# EAGLE design untitled (EAGLE 7.6.0)
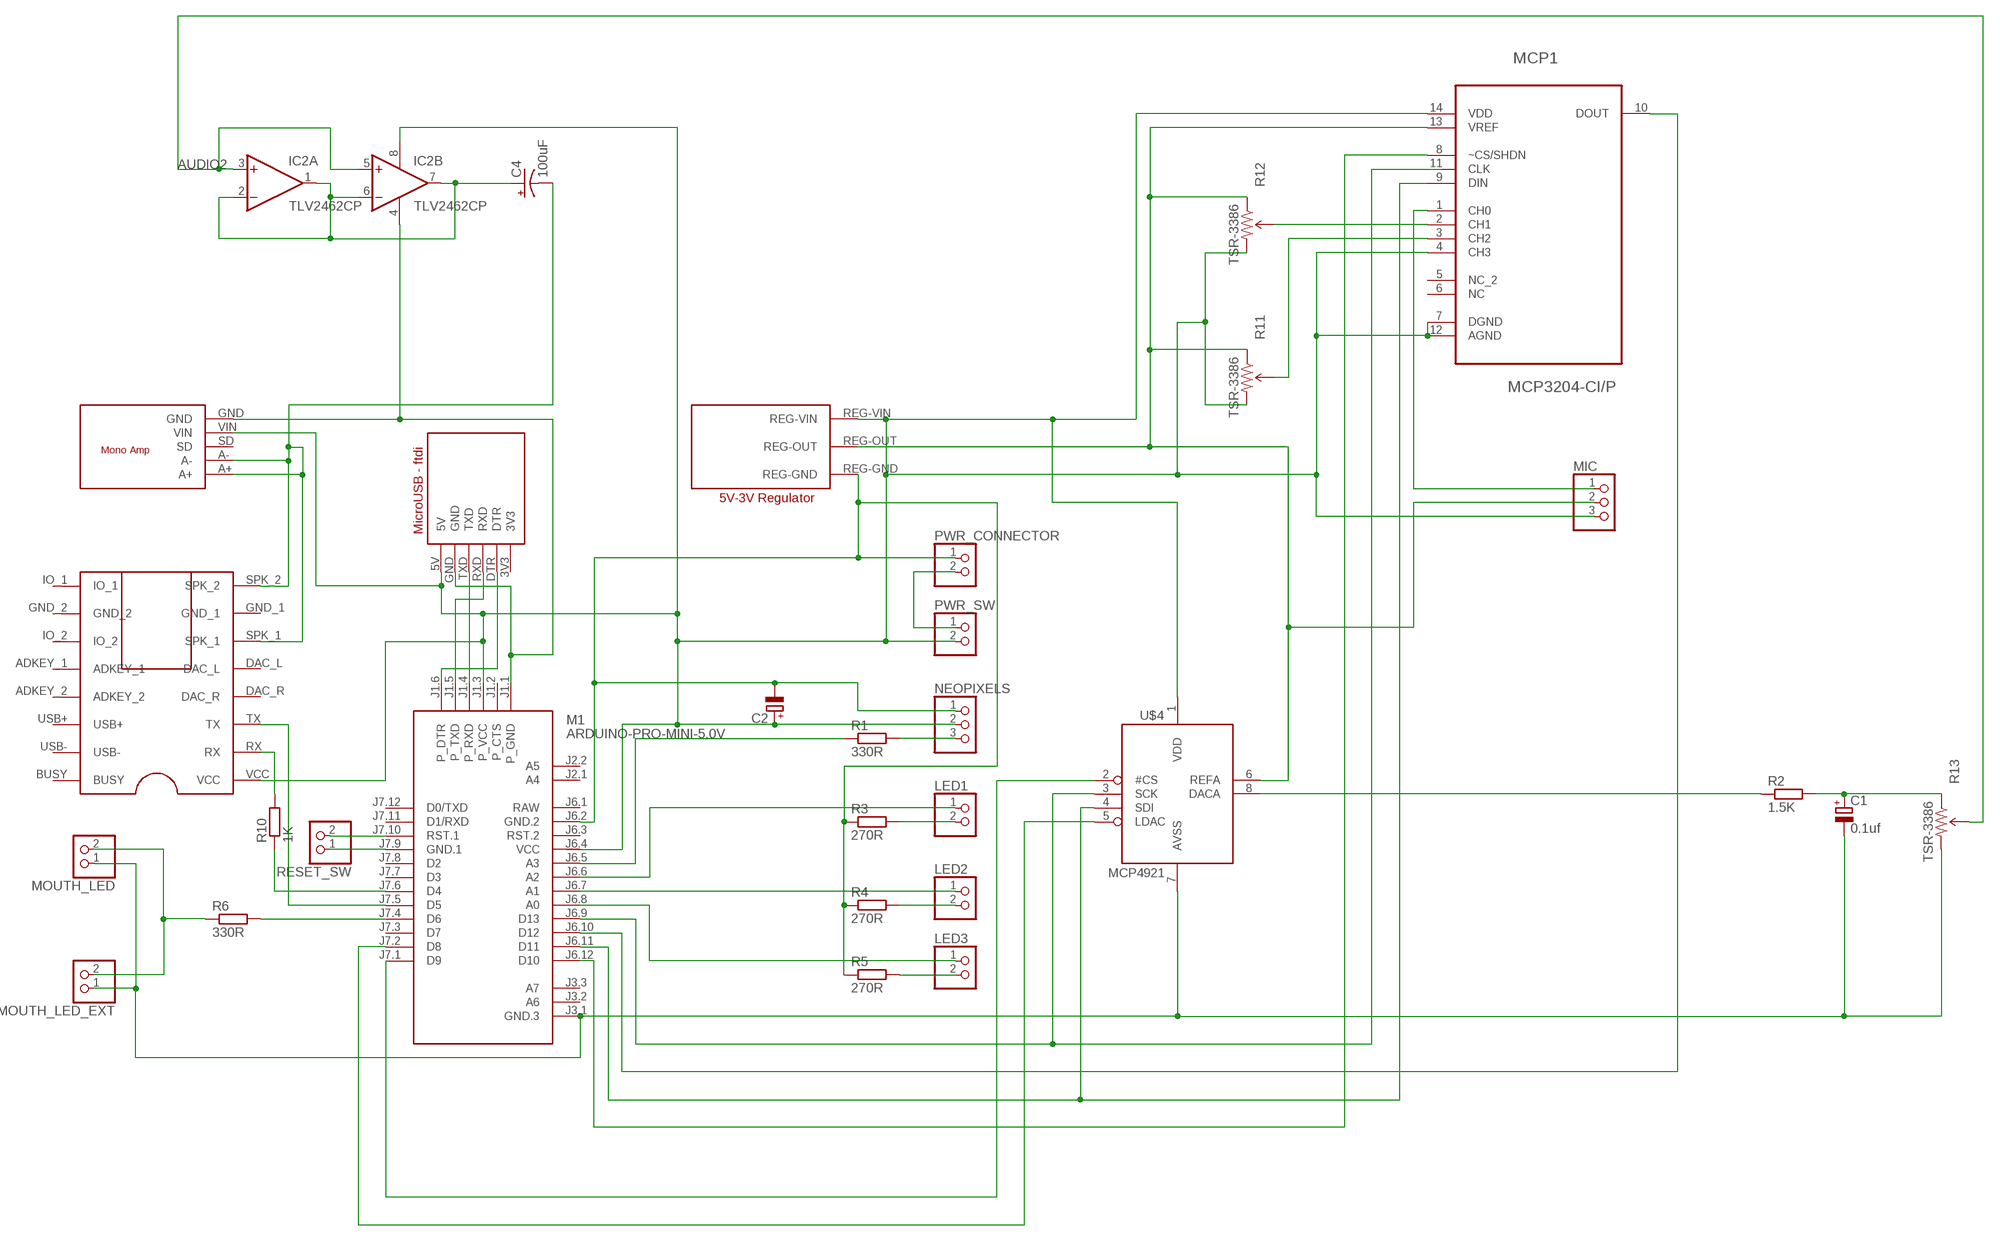
[diagram p0: schematic, sheet 1]

## Parts
C1  0.1uf  CPOL-EUE2,5-6E  [E2,5-6E]
C2  CPOL-EUE2,5-6E  [E2,5-6E]
C4  100uF  CAP_POLPTH1  [CPOL-RADIAL-100UF-25V]
IC2  TLV2462CP  TL072P  [DIL08]
LED1  PINHD-1X2  [1X02]
LED2  PINHD-1X2  [1X02]
LED3  PINHD-1X2  [1X02]
M1  ARDUINO-PRO-MINI-5.0V  [ARDUINO-PRO-MINI]
MCP1  MCP3204-CI/P  [DIP254P762X432-14]
MIC  PINHD-1X3  [1X03]
MOUTH_LED  PINHD-1X2  [1X02]
MOUTH_LED_EXT  PINHD-1X2  [1X02]
NEOPIXELS  PINHD-1X3  [1X03]
PWR_CONNECTOR  PINHD-1X2  [1X02]
PWR_SW  PINHD-1X2  [1X02]
R1  330R  R-EU_0207/7  [0207/7]
R2  1.5K  R-EU_0207/7  [0207/7]
R3  270R  R-EU_0207/7  [0207/7]
R4  270R  R-EU_0207/7  [0207/7]
R5  270R  R-EU_0207/7  [0207/7]
R6  330R  R-EU_0207/7  [0207/7]
R10  1K  R-EU_0207/7  [0207/7]
R11  TSR-3386  TRIMPOT-PTH-KNOB  [3386U]
R12  TSR-3386  TRIMPOT-PTH-KNOB  [3386U]
R13  TSR-3386  TRIMPOT-PTH-KNOB  [3386U]
RESET_SW  PINHD-1X2  [1X02]
U$1  DPLAYER-MINI-DEV  [DPLAYER-MINI-PAC]
U$2  MICRO-USB-DEV  [MICRO-USB-PAC]
U$4  MCP4921  [DIL08]
U$5  5V-TO-3V-REG-DEV  [5V-TO-3V-REG-PAC]
U$6  MONO-AMP-DEV  [MONO-AMP-PAC]

## Nets
AUDIO2: IC2.3(A:+IN) IC2.5(B:+IN) R13.2(WIPER)
AVSS: C1.- M1.J3.1(GND.3) MOUTH_LED.1 MOUTH_LED_EXT.1 R13.3(CW) U$4.7(AVSS)
GND_1: IC2.4(P:V-) M1.J1.1(P_GND) U$2.GND U$6.GND
N$2: NEOPIXELS.3 R1.2
N$3: M1.J1.4(P_RXD) U$2.TXD
N$4: M1.J1.5(P_TXD) U$2.RXD
N$5: M1.J1.6(P_DTR) U$2.DTR
N$6: LED3.1 M1.J6.8(A0)
N$7: LED1.2 R3.2
N$8: LED2.2 R4.2
N$9: C4.2(-) U$1.SPK_1 U$1.SPK_2 U$6.A+ U$6.A-
N$10: LED1.1 M1.J6.6(A2)
N$11: MCP1.2(CH1) R12.2(WIPER)
N$12: PWR_CONNECTOR.2 PWR_SW.1
N$13: M1.J7.5(D5) U$1.TX
N$15: LED2.1 M1.J6.7(A1)
N$16: R10.2 U$1.RX
N$17: LED3.2 R5.2
N$18: M1.J7.6(D4) R10.1
N$19: C2.- M1.J6.2(GND.2) NEOPIXELS.1 PWR_CONNECTOR.1 R3.1 R4.1 R5.1 U$5.REG-GND
N$20: MCP1.13(VREF) MIC.2 R11.1(CCW) R12.1(CCW) U$4.6(REFA) U$5.REG-OUT
N$21: M1.J6.5(A3) R1.1
N$22: M1.J7.10(RST.1) RESET_SW.2
N$23: M1.J7.9(GND.1) RESET_SW.1
N$25: C4.1(+) IC2.1(A:OUT) IC2.2(A:-IN) IC2.6(B:-IN) IC2.7(B:OUT)
N$27: MCP1.3(CH2) R11.2(WIPER)
N$28: M1.J6.9(D13) U$4.3(SCK)
N$29: M1.J6.10(D12) MCP1.10(DOUT)
N$30: M1.J6.12(D10) MCP1.8(~CS/SHDN)
N$31: M1.J6.11(D11) MCP1.9(DIN) U$4.4(SDI)
N$32: MCP1.1(CH0) MIC.1
N$33: C1.+ R2.2 R13.1(CCW)
N$34: M1.J7.4(D6) R6.2
N$35: R2.1 U$4.8(DACA)
N$36: MOUTH_LED.2 MOUTH_LED_EXT.2 R6.1
N$37: M1.J7.1(D9) U$4.2(#CS)
N$38: M1.J7.2(D8) U$4.5(LDAC)
VDD: C2.+ IC2.8(P:V+) M1.J1.3(P_VCC) MCP1.4(CH3) MCP1.7(DGND) MCP1.12(AGND) MCP1.14(VDD) MIC.3 NEOPIXELS.2 PWR_SW.2 R11.3(CW) R12.3(CW) U$1.VCC U$2.5V U$4.1(VDD) U$5.REG-VIN U$6.VIN
Unconnected: M1.J1.2(P_CTS) M1.J2.1(A4) M1.J2.2(A5) M1.J3.2(A6) M1.J3.3(A7) M1.J6.3(RST.2) M1.J7.3(D7) M1.J7.7(D3) M1.J7.8(D2) M1.J7.11(D1/RXD) M1.J7.12(D0/TXD) MCP1.5(NC_2) MCP1.6(NC) MCP1.11(CLK) U$1.ADKEY_1 U$1.ADKEY_2 U$1.BUSY U$1.DAC_L U$1.DAC_R U$1.IO_1 U$1.IO_2 U$1.USB+ U$1.USB- U$6.SD

## Power pins joined to a net without a drawn wire
3V3: U$2.3V3
GND_1: U$1.GND_1
GND_2: U$1.GND_2
RAW: M1.J6.1(RAW)
VCC: M1.J6.4(VCC)

## Library data of the parts
C1 C2 = resistor:CPOL-EU: POLARIZED CAPACITOR, European symbol
C4 = SparkFun-Capacitors:CAP_POL: Capacitor Polarized These are standard SMD and PTH capacitors. Normally 10uF, 47uF, and 100uF in electrolytic and tantalum varieties. Always verify the external diameter of the through hole cap, it varies with capacity, voltage, and manufacturer. The EIA devices should be standard.
IC2 = linear:TL072: OP AMP
LED1-LED3 MOUTH_LED MOUTH_LED_EXT PWR_CONNECTOR PWR_SW RESET_SW = pinhead:PINHD-1X2: PIN HEADER
M1 = diy-modules:ARDUINO-PRO-MINI-*: Arduino Pro Mini
MCP1 = Microchip_By_element14_Batch_1:MCP3204-CI/P: A/D Converters; MPN: MCP3204-CI/P; OC_FARNELL: 9758593; OC_NEWARK: 19C7209; PACKAGE: DIP-14; SUPPLIER: Microchip
MIC NEOPIXELS = pinhead:PINHD-1X3: PIN HEADER
R1-R6 R10 = resistor:R-EU_: RESISTOR, European symbol
R11-R13 = SparkFun-Electromechanical:TRIMPOT: Various small potentiometers for "set-and-forget" applications; PROD_ID: RES-09730
U$1 = Dr_Burrows_library:DPLAYER-MINI-DEV
U$2 = Dr_Burrows_library:MICRO-USB-DEV: MicroUSB FTDI Programmer
U$4 = adafruit:MCP4921
U$5 = Dr_Burrows_library:5V-TO-3V-REG-DEV: 5v to 3v Regulator
U$6 = Dr_Burrows_library:MONO-AMP-DEV

## Board
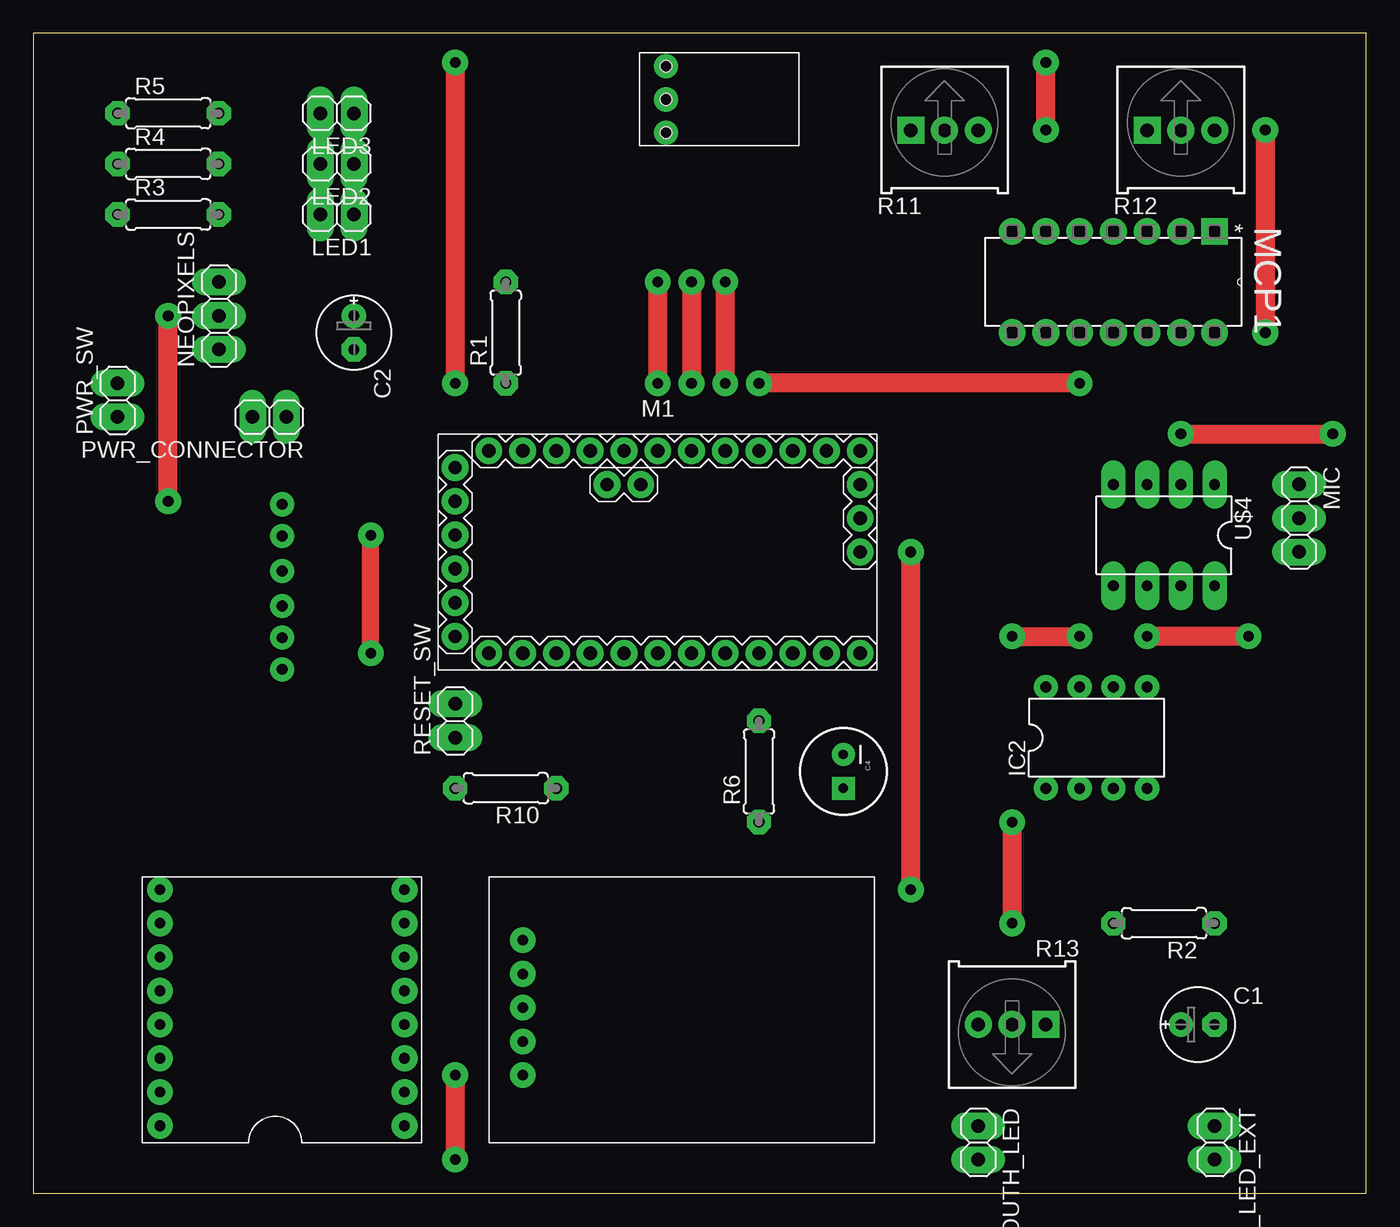
[diagram p1: board, top side]
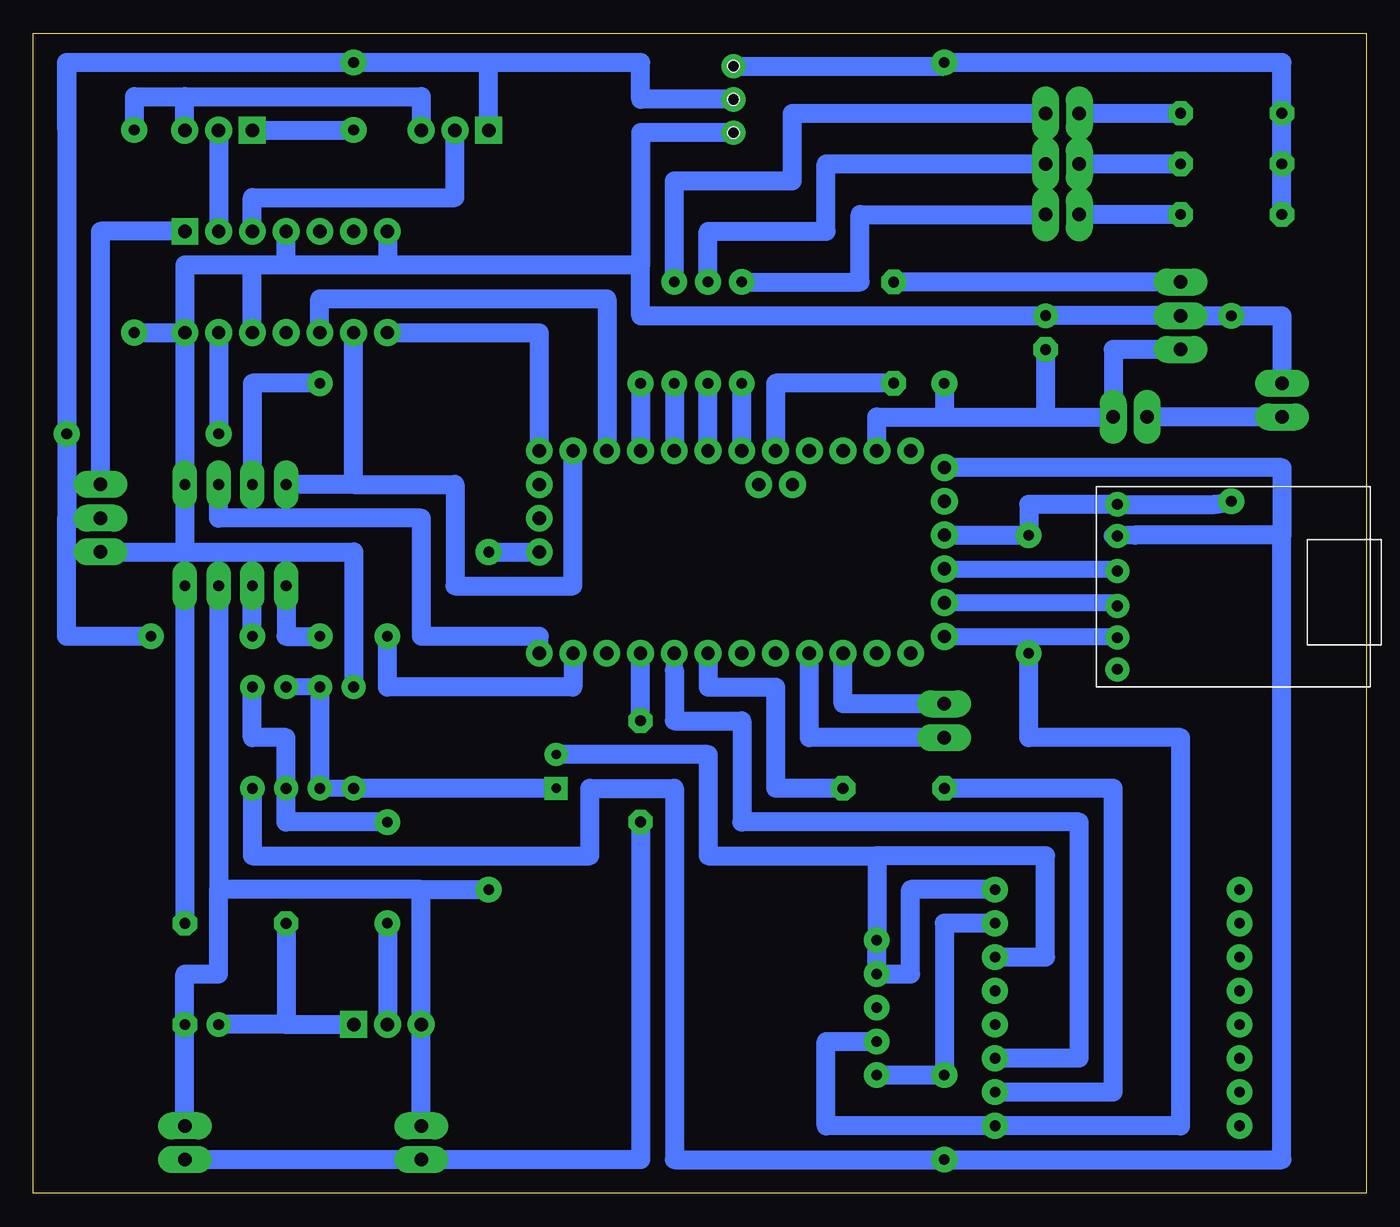
[diagram p2: board, bottom side, seen from below]

Size 100.31 x 87.3 mm. Coordinates in mm from the lower left corner, seen from the top.
Outline: 0,0 100.31,0 100.31,87.3 0,87.3 0,0
Copper layers (1*16): Top 0.035mm / dielectric 1.5mm / Bottom 0.035mm
Design rules "default *": minimum track width 10mil, minimum drill 24mil, track to track 8mil, track to pad 8mil, pad to pad 8mil, via to via 8mil, smd to smd 8mil, copper to edge 40mil, drill to drill 8mil, minimum pad ring 10mil, minimum via ring 8mil, stop-mask expansion 4mil, vias tented up to drill 0mil, thermal gap 10mil

### Footprints (pad centres in the part's own frame; a part is rotated, then mirrored left to right if it is on the bottom)
E2,5-6E = drill 0.813 pad 1.575: + -1.27,0 | drill 0.813 pad 1.575 octagon: - 1.27,0
CPOL-RADIAL-100UF-25V = drill 0.7 pad 1.651 square: 1 1.27,0 | drill 0.7 pad 1.651: 2 -1.27,0
DIL08 = drill 0.813 pad 1.27: 1 -3.81,-3.81; 2 -1.27,-3.81; 3 1.27,-3.81; 4 3.81,-3.81; 5 3.81,3.81; 6 1.27,3.81; 7 -1.27,3.81; 8 -3.81,3.81
1X02 = drill 1.016 long: 1 -1.27,0; 2 1.27,0
ARDUINO-PRO-MINI = drill 1: J1.1 -15.24,6.35; J1.2 -15.24,3.81; J1.3 -15.24,1.27; J1.4 -15.24,-1.27; J1.5 -15.24,-3.81; J1.6 -15.24,-6.35; J2.1 -1.27,5.08; J2.2 -3.81,5.08; J3.1 15.24,0; J3.2 15.24,2.54; J3.3 15.24,5.08; J6.1 -12.7,7.62; J6.2 -10.16,7.62; J6.3 -7.62,7.62; J6.4 -5.08,7.62; J6.5 -2.54,7.62; J6.6 0,7.62; J6.7 2.54,7.62; J6.8 5.08,7.62; J6.9 7.62,7.62; J6.10 10.16,7.62; J6.11 12.7,7.62; J6.12 15.24,7.62; J7.1 15.24,-7.62; J7.2 12.7,-7.62; J7.3 10.16,-7.62; J7.4 7.62,-7.62; J7.5 5.08,-7.62; J7.6 2.54,-7.62; J7.7 0,-7.62; J7.8 -2.54,-7.62; J7.9 -5.08,-7.62; J7.10 -7.62,-7.62; J7.11 -10.16,-7.62; J7.12 -12.7,-7.62
DIP254P762X432-14 = drill 0.991 square: 1 -7.62,15.24 | drill 0.991: 2 -7.62,12.7; 3 -7.62,10.16; 4 -7.62,7.62; 5 -7.62,5.08; 6 -7.62,2.54; 7 -7.62,0; 8 0,0; 9 0,2.54; 10 0,5.08; 11 0,7.62; 12 0,10.16; 13 0,12.7; 14 0,15.24
1X03 = drill 1.016 long: 1 -2.54,0; 2 0,0; 3 2.54,0
0207/7 = drill 0.813 octagon: 1 -3.81,0; 2 3.81,0
3386U = drill 1.016 pad 1.88 square: 1 -2.54,-0.015 | drill 1.016 pad 1.88: 2 0,-0.015; 3 2.54,-0.015
DPLAYER-MINI-PAC = drill 0.8 pad 1.93: ADKEY_1 11.43,19.685; ADKEY_2 8.89,19.685; BUSY 1.27,19.685; DAC_L 11.43,1.27; DAC_R 8.89,1.27; GND_1 16.51,1.27; GND_2 16.51,19.685; IO_1 19.05,19.685; IO_2 13.97,19.685; RX 3.81,1.27; SPK_1 13.97,1.27; SPK_2 19.05,1.27; TX 6.35,1.27; USB+ 6.35,19.685; USB- 3.81,19.685; VCC 1.27,1.27
MICRO-USB-PAC = drill 0.8 pad 1.422: 3V3 1.587,1.333; 5V 1.587,13.748; DTR 1.587,3.715; GND 1.587,11.367; RXD 1.587,6.096; TXD 1.587,8.731
DIL08' = drill 0.813 long: 1 -3.81,-3.81; 2 -1.27,-3.81; 3 1.27,-3.81; 4 3.81,-3.81; 5 3.81,3.81; 6 1.27,3.81; 7 -1.27,3.81; 8 -3.81,3.81
5V-TO-3V-REG-PAC = drill 0.8 pad 1.676: REG-GND 7,-1; REG-OUT 7,1.5; REG-VIN 7,4 | hole 0.9: 7,4; 7,-1; 7,1.5
MONO-AMP-PAC = drill 0.8 pad 1.93: A+ 2.54,15.24; A- 2.54,12.7; GND 2.54,5.08; SD 2.54,10.16; VIN 2.54,7.62

### Placement (x,y rotation side)
C1  87.63,12.7 0 top
C2  24.13,64.77 270 top
C4  60.96,31.75 270 top
IC2  80.01,34.29 0 top
LED1  22.86,73.66 180 top
LED2  22.86,77.47 180 top
LED3  22.86,81.28 180 top
M1  46.99,48.26 0 top
MCP1  73.66,64.77 270 top
MIC  95.25,50.8 270 top
MOUTH_LED  71.12,3.81 270 top
MOUTH_LED_EXT  88.9,3.81 270 top
NEOPIXELS  13.97,66.04 90 top
PWR_CONNECTOR  17.78,58.42 180 top
PWR_SW  6.35,59.69 90 top
R1  35.56,64.77 90 top
R2  85.09,20.32 180 top
R3  10.16,73.66 0 top
R4  10.16,77.47 0 top
R5  10.16,81.28 0 top
R6  54.61,31.75 90 top
R10  35.56,30.48 180 top
R11  68.58,80.01 0 top
R12  86.36,80.01 0 top
R13  73.66,12.7 180 top
RESET_SW  31.75,35.56 90 top
U$1  29.21,3.81 90 top
U$2  20.32,38.1 0 bottom
U$4  MCP4921  [DIL08']  85.09,49.53 180 top
U$5  54.61,83.82 180 top
U$6  34.29,3.81 0 top

### Tracks (layer width: path | path; a pad name or v marks a point on that pad's centre or on a via)
AUDIO2  (via drill 0.8 pad 1.93)
  Top 1.422: v73.66,27.94 v73.66,20.32
  Bottom 1.422: v73.66,20.32 R13.2 | v73.66,27.94 81.28,27.94 IC2.3 81.28,34.29 83.82,34.29 IC2.5
AVSS  (via drill 0.8 pad 1.93)
  Top 1.422: v66.04,22.86 v66.04,48.26
  Bottom 1.422: MOUTH_LED_EXT.1 C1.- 88.9,16.51 86.36,16.51 86.36,22.86 | MOUTH_LED.1 R13.3 71.12,22.86 | 71.12,22.86 86.36,22.86 | U$4.7 86.36,22.86 | v66.04,48.26 M1.J3.1 | 71.12,22.86 v66.04,22.86
GND_1  (via drill 0.8 pad 1.93)
  Top 1.422: v31.75,8.89 v31.75,2.54
  Bottom 1.27: U$2.GND 19.11,49.47
  Bottom 1.422: 6.35,49.53 6.35,2.54 v31.75,2.54 52.07,2.54 52.07,30.48 58.42,30.48 58.42,25.4 83.82,25.4 IC2.4 | M1.J1.1 6.35,54.61 6.35,49.53 | U$6.GND v31.75,8.89 31.75,20.32 U$1.GND_1 | 6.35,49.53 17.4,49.53 U$2.GND
N$2
  Bottom 1.422: NEOPIXELS.3 R1.2
N$3
  Bottom 1.27: M1.J1.4 18.89,46.99 U$2.TXD
N$4
  Bottom 1.27: M1.J1.5 18.99,44.45 U$2.RXD
N$5
  Bottom 1.27: M1.J1.6 18.83,41.91 U$2.DTR
N$6  (via drill 0.8 pad 1.93)
  Top 1.422: v52.07,68.58 v52.07,60.96
  Bottom 1.422: v52.07,60.96 M1.J6.8 | v52.07,68.58 52.07,76.2 43.18,76.2 43.18,81.28 LED3.1
N$7
  Bottom 1.422: R3.2 LED1.2
N$8
  Bottom 1.422: LED2.2 R4.2
N$9
  Bottom 1.422: U$1.SPK_1 24.13,17.78 24.13,25.4 36.83,25.4 | U$1.SPK_2 34.29,22.86 34.29,16.51 U$6.A- U$6.A+ 36.83,25.4 | C4.2 49.53,33.02 49.53,25.4 36.83,25.4
N$10  (via drill 0.8 pad 1.93)
  Top 1.422: v46.99,68.58 v46.99,60.96
  Bottom 1.422: M1.J6.6 v46.99,60.96 | v46.99,68.58 38.1,68.58 38.1,73.66 LED1.1
N$11
  Bottom 1.422: R12.2 MCP1.2
N$12
  Bottom 1.422: PWR_SW.1 PWR_CONNECTOR.2
N$13
  Bottom 1.27: 52.07,39.37 M1.J7.5
  Bottom 1.422: U$1.TX 21.59,10.16 21.59,27.94 46.99,27.94 46.99,35.56 52.07,35.56 52.07,39.37
N$15  (via drill 0.8 pad 1.93)
  Top 1.422: v49.53,68.58 v49.53,60.96
  Bottom 1.422: M1.J6.7 v49.53,60.96 | v49.53,68.58 49.53,72.39 40.64,72.39 40.64,77.47 LED2.1
N$16
  Bottom 1.422: R10.2 19.05,30.48 19.05,7.62 U$1.RX
N$17
  Bottom 1.422: LED3.2 R5.2
N$18
  Bottom 1.422: R10.1 44.45,30.48 44.45,38.1 49.53,38.1 M1.J7.6
N$19  (via drill 0.8 pad 1.93)
  Top 1.422: v31.75,85.09 v31.75,60.96
  Bottom 1.422: v31.75,60.96 31.75,58.42 | 31.75,58.42 24.13,58.42 | 24.13,58.42 PWR_CONNECTOR.1 19.05,63.5 NEOPIXELS.1 | R3.1 R4.1 | R4.1 R5.1 | R4.1 6.35,85.09 v31.75,85.09 31.75,84.82 U$5.REG-GND | M1.J6.2 36.83,58.42 31.75,58.42 | C2.- 24.13,58.42
N$20  (via drill 0.8 pad 1.93)
  Top 1.422: v86.36,57.15 v97.79,57.15 | v91.44,41.91 v83.82,41.91 | v76.2,80.01 v76.2,85.09
  Bottom 1.422: MCP1.13 v86.36,57.15 | 97.79,50.8 v97.79,57.15 97.79,85.09 | v83.82,41.91 U$4.6 | 97.79,50.8 MIC.2 | 97.78,80.03 97.79,85.09 | U$5.REG-OUT 54.61,82.32 54.61,85.09 66.04,85.09 | 66.04,85.09 v76.2,85.09 97.79,85.09 | v91.44,41.91 97.79,41.91 97.79,50.8 | R11.1 66.04,85.09 | R12.1 76.2,80 v76.2,80.01
N$21
  Bottom 1.422: R1.1 44.45,60.96 M1.J6.5
N$22
  Bottom 1.422: RESET_SW.2 39.37,36.83 M1.J7.10
N$23
  Bottom 1.422: RESET_SW.1 41.91,34.29 M1.J7.9
N$25
  Bottom 1.27: IC2.1 IC2.2 | IC2.7 IC2.6
  Bottom 1.422: IC2.7 IC2.2 | C4.1 IC2.1
N$27
  Bottom 1.422: MCP1.3 83.82,74.93 68.58,74.93 R11.2
N$28  (via drill 0.8 pad 1.93)
  Top 1.422: v78.74,60.96 v54.61,60.96
  Bottom 1.422: v54.61,60.96 M1.J6.9 | v78.74,60.96 83.82,60.96 U$4.3
N$29
  Bottom 1.422: MCP1.10 78.74,67.31 57.15,67.31 M1.J6.10
N$30
  Bottom 1.422: MCP1.8 62.23,64.77 M1.J6.12
N$31
  Bottom 1.422: 76.2,53.34 MCP1.9 | M1.J6.11 59.69,45.72 68.58,45.72 68.58,53.34 76.2,53.34 | 76.2,53.34 U$4.4
N$32
  Bottom 1.422: MCP1.1 95.25,72.39 MIC.1
N$33
  Bottom 1.422: 81.28,12.7 R13.1 | R2.2 81.28,12.7 | 81.28,12.7 C1.+
N$34
  Bottom 1.422: R6.2 M1.J7.4
N$35
  Bottom 1.422: U$4.8 R2.1
N$36
  Bottom 1.422: MOUTH_LED_EXT.2 MOUTH_LED.2 54.61,2.54 R6.1
N$37
  Bottom 1.422: U$4.2 86.36,50.8 71.12,50.8 71.12,41.91 62.23,41.91 M1.J7.1
N$38  (via drill 0.8 pad 1.93)
  Top 1.422: v73.66,41.91 v78.74,41.91
  Bottom 1.422: M1.J7.2 59.69,38.1 73.66,38.1 v73.66,41.91 | U$4.5 81.28,41.91 v78.74,41.91
VDD  (via drill 0.8 pad 1.93)
  Top 1.27: v25.4,40.64 v25.4,49.53
  Top 1.422: v92.71,80.01 v92.71,64.77 | v10.16,52.07 v10.16,66.04
  Bottom 1.422: 81.28,69.85 MCP1.4 | MCP1.12 83.82,69.85 | 83.82,69.85 88.9,69.85 MCP1.14 | PWR_SW.2 6.35,66.04 v10.16,66.04 NEOPIXELS.2 C2.+ 54.61,66.04 54.61,69.85 | MCP1.7 73.66,69.85 | 73.66,69.85 81.28,69.85 | 81.28,69.85 83.82,69.85 | 88.9,48.26 U$4.1 MCP1.14 | 88.9,48.26 76.2,48.26 IC2.8 | 54.61,69.85 73.66,69.85 | MIC.3 88.9,48.26 | U$5.REG-VIN 54.61,79.82 54.61,69.85 | v92.71,80.01 92.71,82.53 88.9,82.53 | v92.71,64.77 MCP1.14 | 88.9,82.53 71.12,82.53 R11.3 | R12.3 88.9,82.53 | v25.4,40.64 25.4,34.29 13.97,34.29 13.97,5.08 U$1.VCC 40.64,5.08 40.64,11.43 U$6.VIN | M1.J1.3 v25.4,49.53 25.4,51.85 U$2.5V 11.43,51.85 v10.16,52.07